# Altium schematic sheet ACMeasuremets.SchDoc
size A; SheetNumber: 2; SheetTotal: 3
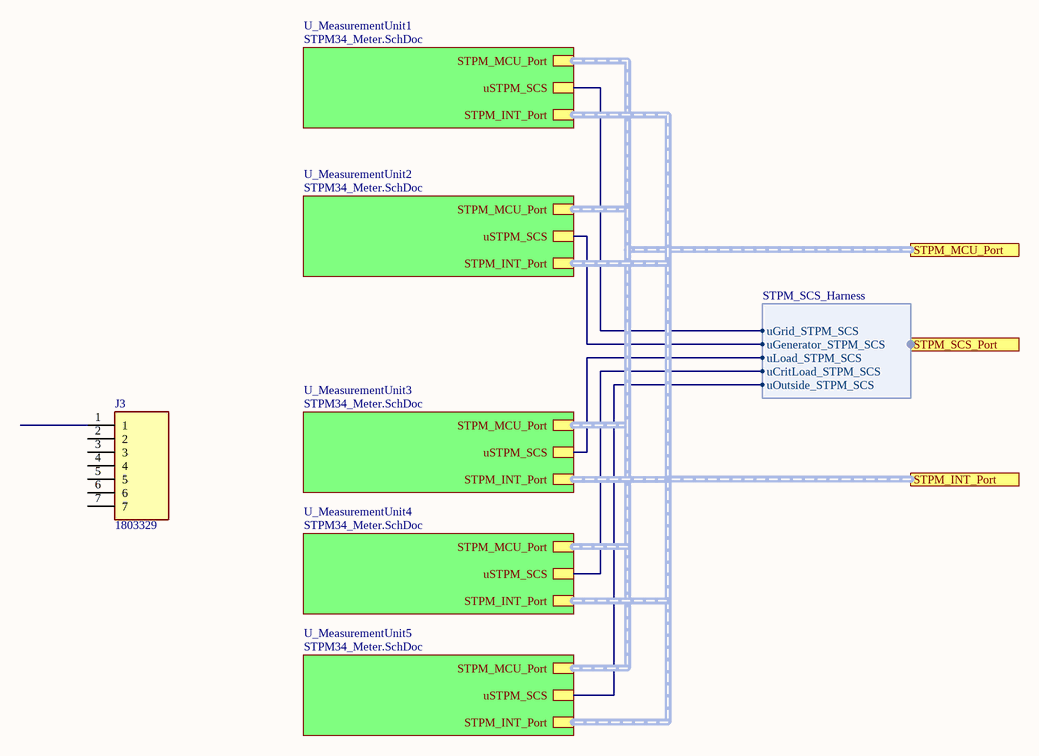
[diagram p0: ACMeasuremets.SchDoc]

## Parts
J3  1803329  [SHDRRA7W83P0X381_1X7_2806X920X825P]

## Sub-sheets
U_MeasurementUnit1 = STPM34_Meter.SchDoc: STPM_MCU_Port (harness STPM_MCU_Harness), uSTPM_SCS, STPM_INT_Port (harness STPM_INT_Harness)
U_MeasurementUnit2 = STPM34_Meter.SchDoc: STPM_MCU_Port (harness STPM_MCU_Harness), uSTPM_SCS, STPM_INT_Port (harness STPM_INT_Harness)
U_MeasurementUnit3 = STPM34_Meter.SchDoc: STPM_MCU_Port (harness STPM_MCU_Harness), uSTPM_SCS, STPM_INT_Port (harness STPM_INT_Harness)
U_MeasurementUnit4 = STPM34_Meter.SchDoc: STPM_MCU_Port (harness STPM_MCU_Harness), uSTPM_SCS, STPM_INT_Port (harness STPM_INT_Harness)
U_MeasurementUnit5 = STPM34_Meter.SchDoc: STPM_MCU_Port (harness STPM_MCU_Harness), uSTPM_SCS, STPM_INT_Port (harness STPM_INT_Harness)

## Ports
STPM_INT_Port (harness STPM_MCU_Harness), STPM_MCU_Port (harness STPM_MCU_Harness), STPM_SCS_Port (harness STPM_SCS_Harness)

## Harnesses
STPM_SCS_Harness: uGrid_STPM_SCS, uGenerator_STPM_SCS, uLoad_STPM_SCS, uCritLoad_STPM_SCS, uOutside_STPM_SCS

## Nets
(unnamed): sheet U_MeasurementUnit4/uSTPM_SCS, port STPM_SCS_Port.uCritLoad_STPM_SCS
(unnamed): sheet U_MeasurementUnit3/uSTPM_SCS, port STPM_SCS_Port.uLoad_STPM_SCS
(unnamed): sheet U_MeasurementUnit2/uSTPM_SCS, port STPM_SCS_Port.uGenerator_STPM_SCS
(unnamed): sheet U_MeasurementUnit1/uSTPM_SCS, port STPM_SCS_Port.uGrid_STPM_SCS
(unnamed): sheet U_MeasurementUnit5/uSTPM_SCS, port STPM_SCS_Port.uOutside_STPM_SCS

Not connected (* = marked no-connect by the designer): J3 1 2 3 4 5 6 7

## Buses and harness runs
harness port STPM_INT_Port = sheet U_MeasurementUnit1/STPM_INT_Port = sheet U_MeasurementUnit2/STPM_INT_Port = sheet U_MeasurementUnit3/STPM_INT_Port = sheet U_MeasurementUnit4/STPM_INT_Port = sheet U_MeasurementUnit5/STPM_INT_Port
harness port STPM_MCU_Port = sheet U_MeasurementUnit1/STPM_MCU_Port = sheet U_MeasurementUnit2/STPM_MCU_Port = sheet U_MeasurementUnit3/STPM_MCU_Port = sheet U_MeasurementUnit4/STPM_MCU_Port = sheet U_MeasurementUnit5/STPM_MCU_Port

## Library data of the parts
J3 = 1803329: Connector; Manufacturer_Name: Phoenix Contact; Datasheet Link: http://www.phoenixcontact.com/gb/produkte/1803329; Height: 8.25mm; Manufacturer_Part_Number: 1803329; Mouser Part Number: 651-1803329; Mouser Price/Stock: https://www.mouser.co.uk/ProductDetail/Phoenix-Contact/1803329?qs=%2FbRkJSLTVS9rpm6GtFTPVA%3D%3D; Arrow Part Number: 1803329; Arrow Price/Stock: https://www.arrow.com/en/products/1803329/phoenix-contact?region=nac; Digi-Key_Part_Number: 277-1211-ND